# EAGLE design SensorU (EAGLE 7.2.0)
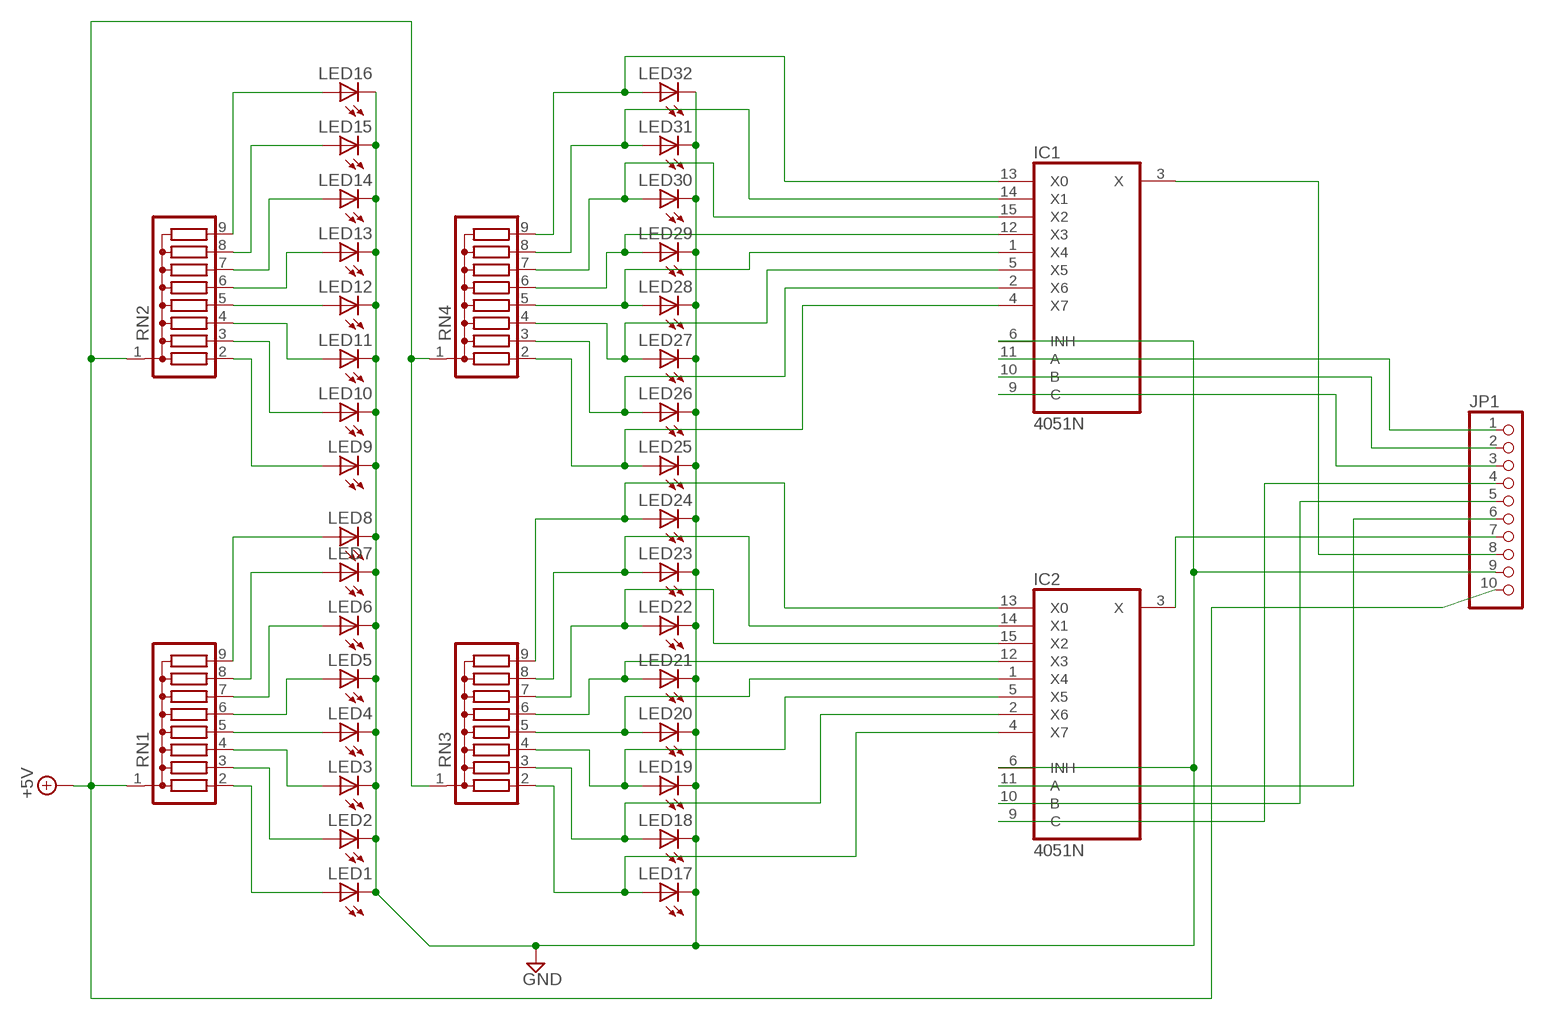
[diagram p0: schematic, sheet 1]

## Parts
IC1  4051N  [DIL16]
IC2  4051N  [DIL16]
JP1  PINHD-1X10  [1X10]
LED1  LED3MM  [LED3MM]
LED2  LED3MM  [LED3MM]
LED3  LED3MM  [LED3MM]
LED4  LED3MM  [LED3MM]
LED5  LED3MM  [LED3MM]
LED6  LED3MM  [LED3MM]
LED7  LED3MM  [LED3MM]
LED8  LED3MM  [LED3MM]
LED9  LED3MM  [LED3MM]
LED10  LED3MM  [LED3MM]
LED11  LED3MM  [LED3MM]
LED12  LED3MM  [LED3MM]
LED13  LED3MM  [LED3MM]
LED14  LED3MM  [LED3MM]
LED15  LED3MM  [LED3MM]
LED16  LED3MM  [LED3MM]
LED17  LED3MM  [LED3MM]
LED18  LED3MM  [LED3MM]
LED19  LED3MM  [LED3MM]
LED20  LED3MM  [LED3MM]
LED21  LED3MM  [LED3MM]
LED22  LED3MM  [LED3MM]
LED23  LED3MM  [LED3MM]
LED24  LED3MM  [LED3MM]
LED25  LED3MM  [LED3MM]
LED26  LED3MM  [LED3MM]
LED27  LED3MM  [LED3MM]
LED28  LED3MM  [LED3MM]
LED29  LED3MM  [LED3MM]
LED30  LED3MM  [LED3MM]
LED31  LED3MM  [LED3MM]
LED32  LED3MM  [LED3MM]
RN1  G08R  [SIL9]
RN2  G08R  [SIL9]
RN3  G08R  [SIL9]
RN4  G08R  [SIL9]

## Nets
+5V: JP1.10 RN1.1 RN2.1 RN3.1 RN4.1
GND: IC1.6(INH) IC2.6(INH) JP1.9 LED1.K(C) LED2.K(C) LED3.K(C) LED4.K(C) LED5.K(C) LED6.K(C) LED7.K(C) LED8.K(C) LED9.K(C) LED10.K(C) LED11.K(C) LED12.K(C) LED13.K(C) LED14.K(C) LED15.K(C) LED16.K(C) LED17.K(C) LED18.K(C) LED19.K(C) LED20.K(C) LED21.K(C) LED22.K(C) LED23.K(C) LED24.K(C) LED25.K(C) LED26.K(C) LED27.K(C) LED28.K(C) LED29.K(C) LED30.K(C) LED31.K(C) LED32.K(C)
N$1: LED16.A RN2.9
N$2: LED15.A RN2.8
N$3: LED14.A RN2.7
N$4: LED13.A RN2.6
N$5: LED12.A RN2.5
N$6: LED11.A RN2.4
N$7: LED10.A RN2.3
N$8: LED9.A RN2.2
N$9: LED1.A RN1.2
N$10: LED2.A RN1.3
N$11: LED3.A RN1.4
N$12: LED4.A RN1.5
N$13: LED5.A RN1.6
N$14: LED6.A RN1.7
N$15: LED7.A RN1.8
N$16: LED8.A RN1.9
N$17: IC2.3(X) JP1.7
N$18: IC1.3(X) JP1.8
N$19: IC1.11(A) JP1.1
N$20: IC1.10(B) JP1.2
N$21: IC1.9(C) JP1.3
N$22: IC2.9(C) JP1.4
N$23: IC2.10(B) JP1.5
N$24: IC2.11(A) JP1.6
N$33: IC1.13(X0) LED32.A RN4.9
N$34: IC1.14(X1) LED31.A RN4.8
N$35: IC1.15(X2) LED30.A RN4.7
N$36: IC1.12(X3) LED29.A RN4.6
N$37: IC1.1(X4) LED28.A RN4.5
N$38: IC1.5(X5) LED27.A RN4.4
N$39: IC1.2(X6) LED26.A RN4.3
N$40: IC1.4(X7) LED25.A RN4.2
N$41: IC2.13(X0) LED24.A RN3.9
N$42: IC2.14(X1) LED23.A RN3.8
N$43: IC2.15(X2) LED22.A RN3.7
N$44: IC2.12(X3) LED21.A RN3.6
N$45: IC2.1(X4) LED20.A RN3.5
N$46: IC2.5(X5) LED19.A RN3.4
N$47: IC2.2(X6) LED18.A RN3.3
N$48: IC2.4(X7) LED17.A RN3.2

## Power pins joined to a net without a drawn wire
+5V: IC1.16(VCC) IC2.16(VCC)
GND: IC1.7(VEE) IC1.8(GND) IC2.7(VEE) IC2.8(GND)

## Library data of the parts
IC1 IC2 = 40xx:4051: 8-channel ANALOG MULTIPLEXER
JP1 = pinhead:PINHD-1X10: PIN HEADER
LED1-LED32 = led:LED: LED OSRAM: - CHIPLED LG R971, LG N971, LY N971, LG Q971, LY Q971, LO R971, LY R971 LH N974, LH R974 LS Q976, LO Q976, LY Q976 LO Q996 - Hyper CHIPLED LW Q18S LB Q993, LB Q99A, LB R99A - SideLED LS A670, LO A670, LY A670, LG A670, LP A670 LB A673, LV A673, LT A673, LW A673 LH A674 LY A675 LS A676, LA A676, LO A676, LY A676, LW A676 LS A679, LY A679, LG A679 - Hyper Micro SIDELED® LS Y876, LA Y876, LO Y876, LY Y876 LT Y87S - SmartLED LW L88C, LW L88S LB L89C, LB L89S, LG L890 LS L89K, LO L89K, LY L89K LS L896, LA L896, LO L896, LY L896 - TOPLED LS T670, LO T670, LY T670, LG T670, LP T670 LSG T670, LSP T670, LSY T670, LOP T670, LYG T670 LG T671, LOG T671, LSG T671 LB T673, LV T673, LT T673, LW T673 LH T674 LS T676, LA T676, LO T676, LY T676, LB T676, LH T676, LSB T676, LW T676 LB T67C, LV T67C, LT T67C, LS T67K, LO T67K, LY T67K, LW E67C LS E67B, LA E67B, LO E67B, LY E67B, LB E67C, LV E67C, LT E67C LW T67C LS T679, LY T679, LG T679 LS T770, LO T770, LY T770, LG T770, LP T770 LB T773, LV T773, LT T773, LW T773 LH T774 LS E675, LA E675, LY E675, LS T675 LS T776, LA T776, LO T776, LY T776, LB T776 LHGB T686 LT T68C, LB T68C - Hyper Mini TOPLED® LB M676 - Mini TOPLED Santana® LG M470 LS M47K, LO M47K, LY M47K Source: http://www.osram.convergy.de LUXEON: - LUMILED® LXK2-PW12-R00, LXK2-PW12-S00, LXK2-PW14-U00, LXK2-PW14-V00 LXK2-PM12-R00, LXK2-PM12-S00, LXK2-PM14-U00 LXK2-PE12-Q00, LXK2-PE12-R00, LXK2-PE12-S00, LXK2-PE14-T00, LXK2-PE14-U00 LXK2-PB12-K00, LXK2-PB12-L00, LXK2-PB12-M00, LXK2-PB14-N00, LXK2-PB14-P00, LXK2-PB14-Q00 LXK2-PR12-L00, LXK2-PR12-M00, LXK2-PR14-Q00, LXK2-PR14-R00 LXK2-PD12-Q00, LXK2-PD12-R00, LXK2-PD12-S00 LXK2-PH12-R00, LXK2-PH12-S00 LXK2-PL12-P00, LXK2-PL12-Q00, LXK2-PL12-R00 Source: www.luxeon.com KINGBRIGHT: KA-3528ASYC Source: www.kingbright.com
RN1-RN4 = resistor-sil:G08R: SIL RESISTOR; OC_FARNELL: unknown; OC_NEWARK: unknown

## Board
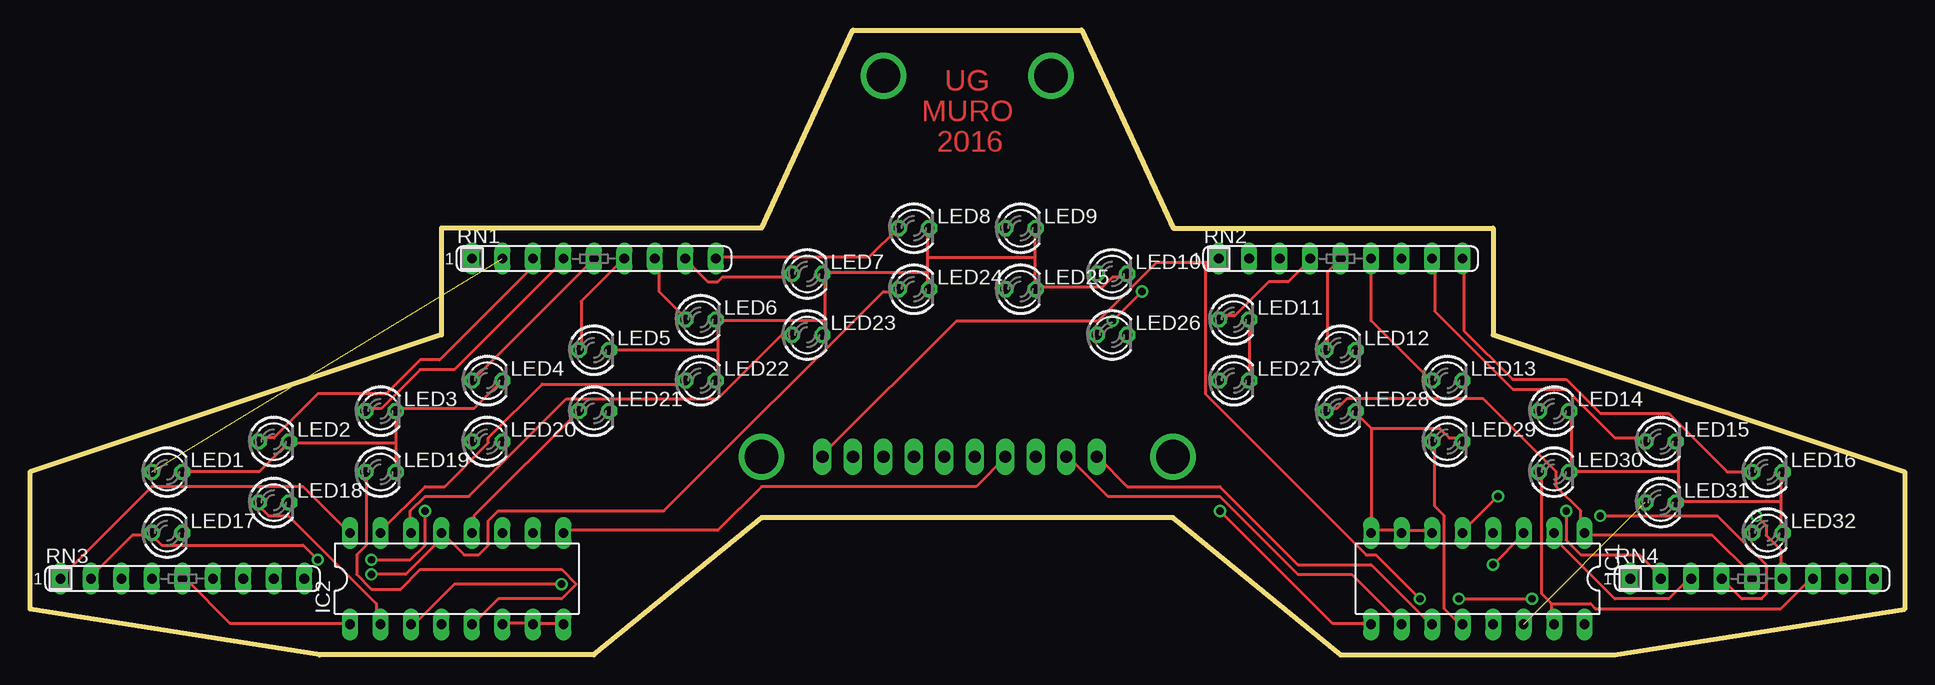
[diagram p1: board, top side]
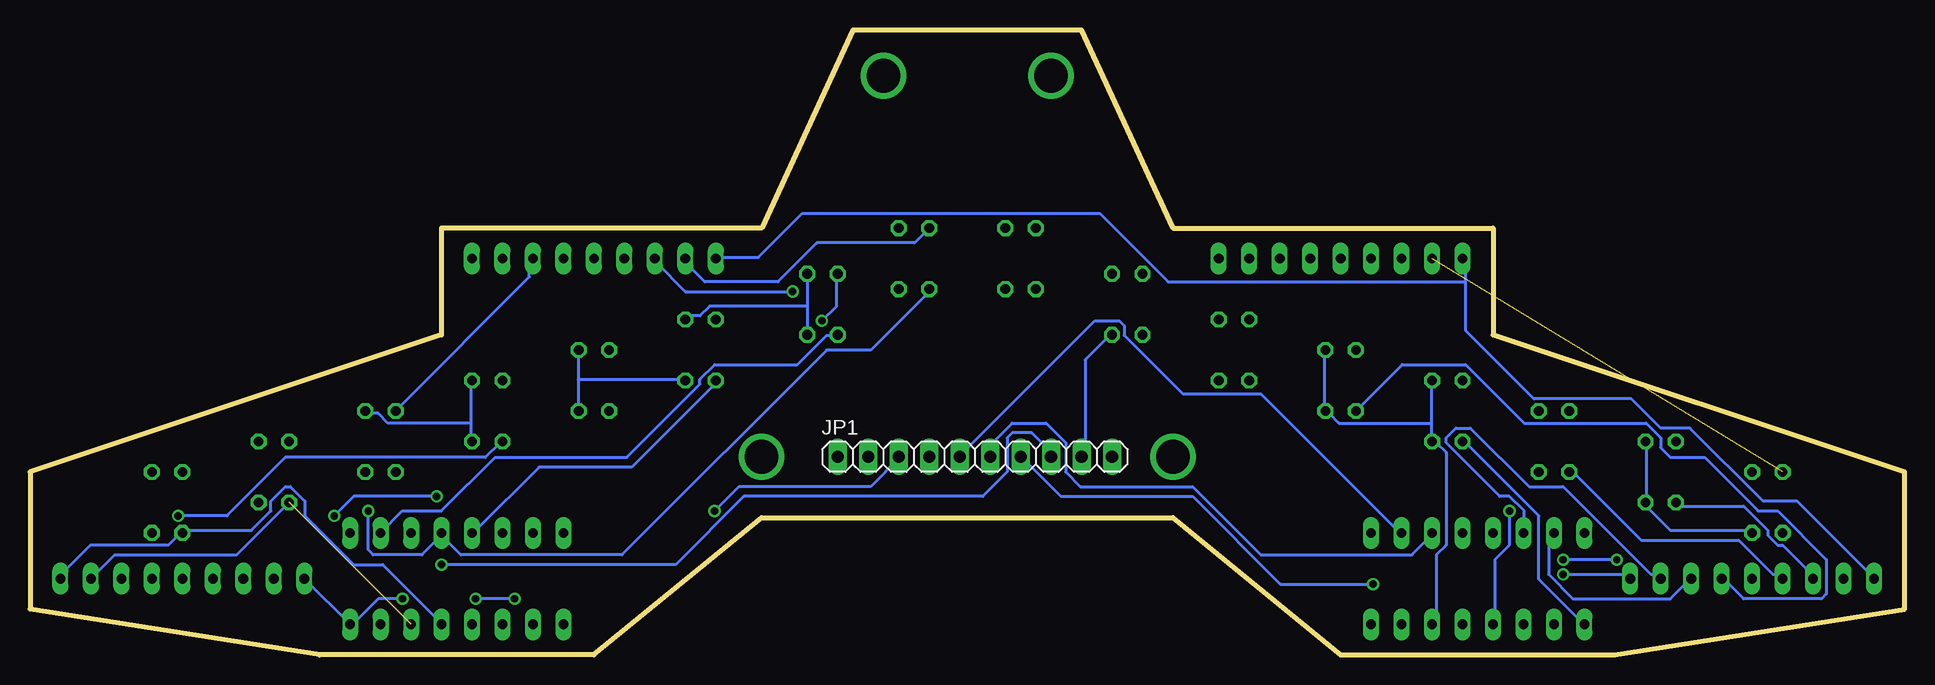
[diagram p2: board, bottom side, seen from below]

Size 156.21 x 52.07 mm. Coordinates in mm from the lower left corner, seen from the top.
Outline: 60.96,35.56 68.58,52.07 87.63,52.07 95.25,35.56 121.92,35.56 121.92,26.67 156.21,15.24 156.21,3.81 132.08,0 109.22,0 95.25,11.43 60.96,11.43 46.99,0 24.13,0 0,3.81 0,15.24 34.29,26.67 34.29,35.56 60.96,35.56
Copper layers (1*16): Top 0.035mm / dielectric 1.5mm / Bottom 0.035mm
Design rules "default": minimum track width 10mil, minimum drill 24mil, track to track 8mil, track to pad 8mil, pad to pad 8mil, via to via 8mil, smd to smd 8mil, copper to edge 40mil, drill to drill 8mil, minimum pad ring 10mil, minimum via ring 8mil, stop-mask expansion 4mil, vias tented up to drill 0mil, thermal gap 10mil

### Footprints (pad centres in the part's own frame; a part is rotated, then mirrored left to right if it is on the bottom)
DIL16 = drill 0.813 long: 1 -8.89,-3.81; 2 -6.35,-3.81; 3 -3.81,-3.81; 4 -1.27,-3.81; 5 1.27,-3.81; 6 3.81,-3.81; 7 6.35,-3.81; 8 8.89,-3.81; 9 8.89,3.81; 10 6.35,3.81; 11 3.81,3.81; 12 1.27,3.81; 13 -1.27,3.81; 14 -3.81,3.81; 15 -6.35,3.81; 16 -8.89,3.81
1X10 = drill 1.016 long: 1 -11.43,0; 2 -8.89,0; 3 -6.35,0; 4 -3.81,0; 5 -1.27,0; 6 1.27,0; 7 3.81,0; 8 6.35,0; 9 8.89,0; 10 11.43,0
LED3MM = drill 0.813 octagon: A -1.27,0; K 1.27,0
SIL9 = drill 0.813 long: 1 -10.16,0; 2 -7.62,0; 3 -5.08,0; 4 -2.54,0; 5 0,0; 6 2.54,0; 7 5.08,0; 8 7.62,0; 9 10.16,0

### Placement (x,y rotation side)
IC1  120.65,6.35 180 top
IC2  35.56,6.35 0 top
JP1  77.47,16.51 0 bottom
LED1  11.43,15.24 0 top
LED2  20.32,17.78 0 top
LED3  29.21,20.32 0 top
LED4  38.1,22.86 0 top
LED5  46.99,25.4 0 top
LED6  55.88,27.94 0 top
LED7  64.77,31.75 0 top
LED8  73.66,35.56 0 top
LED9  82.55,35.56 0 top
LED10  90.17,31.75 0 top
LED11  100.33,27.94 0 top
LED12  109.22,25.4 0 top
LED13  118.11,22.86 0 top
LED14  127,20.32 0 top
LED15  135.89,17.78 0 top
LED16  144.78,15.24 0 top
LED17  11.43,10.16 0 top
LED18  20.32,12.7 0 top
LED19  29.21,15.24 0 top
LED20  38.1,17.78 0 top
LED21  46.99,20.32 0 top
LED22  55.88,22.86 0 top
LED23  64.77,26.67 0 top
LED24  73.66,30.48 0 top
LED25  82.55,30.48 0 top
LED26  90.17,26.67 0 top
LED27  100.33,22.86 0 top
LED28  109.22,20.32 0 top
LED29  118.11,17.78 0 top
LED30  127,15.24 0 top
LED31  135.89,12.7 0 top
LED32  144.78,10.16 0 top
RN1  46.99,33.02 0 top
RN2  109.22,33.02 0 top
RN3  12.7,6.35 0 top
RN4  143.51,6.35 0 top

### Tracks (layer width: path | path; a pad name or v marks a point on that pad's centre or on a via)
+5V  (via drill 0.61)
  Top 0.254: RN3.1 2.85,6.71 10.16,14.02 22.76,14.02 26.42,10.36 IC2.16 | 97.94,32.72 93.88,32.72 89,27.84 77.22,27.84 66.24,16.87 JP1.10 | 97.94,32.72 98.75,32.72 RN2.1 | v119.08,4.67 v125.17,4.67 | v115.82,4.67 112.17,8.33 111.35,8.33 97.94,21.74 97.94,32.72
  Bottom 0.254: 36.58,31.09 36.58,27.03 30.89,21.34 22.76,21.34 20.32,18.9 17.88,18.9 11.79,12.8 8.94,12.8 2.85,6.71 RN3.1 | 36.58,31.09 36.58,32.72 RN1.1 | RN4.1 IC1.16 129.24,2.64 127.2,4.67 v125.17,4.67 | v115.82,4.67 v119.08,4.67 | 36.58,31.09 61.37,31.09 67.06,36.78 91.85,36.78 95.5,33.12 98.75,33.12 RN2.1
GND
  Top 0.254: 128.42,15.24 128.42,20.12 LED14.K | 145.9,12.8 145.9,15.24 LED16.K | 145.9,12.8 145.9,10.36 LED32.K | 137.36,15.24 137.36,17.68 LED15.K | 137.36,15.24 137.36,12.8 | 137.36,12.8 145.9,12.8 | 137.36,12.8 LED31.K | 137.36,15.24 128.42,15.24 | 128.42,15.24 LED30.K | LED11.K LED27.K | 111.76,10.36 114.2,10.36 IC1.7 114.61,10.36 116.64,10.36 IC1.6 | 111.76,18.9 111.76,10.36 | 111.76,18.9 110.54,20.12 LED28.K | 111.76,10.36 IC1.8 | 111.76,18.9 117.45,18.9 118.26,18.09 119.08,18.09 LED29.K | 30.48,17.68 LED3.K 30.48,20.52 36.98,20.52 39.01,22.55 LED4.K | 30.48,17.68 LED19.K | LED1.K 19.1,15.24 21.54,17.68 LED2.K 21.95,17.68 30.48,17.68 | IC2.6 39.42,2.64 41.86,2.64 IC2.7 42.27,2.64 44.3,2.64 IC2.8 | 83.72,33.12 83.72,35.56 LED9.K | 83.72,33.12 83.72,30.68 LED25.K 84.12,30.68 89.41,30.68 90.22,31.5 91.44,31.5 LED10.K | 57.3,27.84 57.3,25.4 | 57.3,25.4 57.3,22.96 LED22.K | 57.3,25.4 LED5.K | 74.78,33.12 74.78,35.56 LED8.K | 74.78,33.12 74.78,31.9 | 74.78,31.9 74.78,30.68 LED24.K | 66.24,27.84 66.24,31.5 LED7.K 66.24,31.9 74.78,31.9 | 66.24,27.84 66.24,27.03 LED23.K | 66.24,27.84 57.3,27.84 | 57.3,27.84 LED6.K | 74.78,33.12 83.72,33.12
  Bottom 0.254: 119.48,19.3 119.48,22.55 LED13.K | 119.48,19.3 119.48,18.09 LED29.K | 110.54,22.96 110.54,25.4 LED12.K | 110.54,22.96 110.54,20.52 LED28.K | 110.54,22.96 101.6,22.96 LED27.K | 119.48,19.3 126.39,19.3 127.2,20.12 128.02,20.12 LED14.K | LED17.K 13.01,10.36 19.51,10.36 21.54,12.39 LED18.K 21.54,12.8 21.54,17.68 LED2.K | 39.42,19.3 39.42,22.55 LED4.K | 39.42,19.3 39.42,18.09 LED20.K 39.01,17.68 38.2,16.87 38.2,9.14 39.01,8.33 39.01,2.64 IC2.6 | LED10.K 91.44,29.06 | 91.44,29.06 LED26.K | LED5.K 48.36,25.4 48.36,20.52 LED21.K 47.95,20.12 47.14,19.3 39.42,19.3 | JP1.9 68.28,16.87 68.28,24.59 66.24,26.62 LED23.K | 91.44,29.06 99.57,29.06 100.38,28.24 101.6,28.24 LED11.K
N$1
  Top 0.254: LED16.A 141.43,15.24 136.55,20.12 130.86,20.12 128.02,22.96 123.55,22.96 119.48,27.03 119.48,32.72 RN2.9
N$2
  Top 0.254: LED15.A 134.52,18.09 132.08,18.09 128.02,22.15 123.55,22.15 117.04,28.65 117.04,32.72 RN2.8
N$3
  Bottom 0.254: RN2.7 114.61,32.72 114.61,31.5 125.58,20.52 LED14.A
N$4
  Top 0.254: RN2.6 111.76,27.84 116.64,22.96 LED13.A
N$5
  Top 0.254: RN2.5 108.1,31.9 108.1,25.4 LED12.A
N$6
  Top 0.254: LED11.A 99.16,28.24 100.38,28.24 103.23,31.09 104.85,31.09 106.48,32.72 RN2.4
N$7  (via drill 0.61)
  Top 0.254: v92.66,30.28 v90.22,27.84
  Bottom 0.254: v90.22,27.84 89,29.06 89,31.5 LED10.A | v92.66,30.28 101.6,30.28 104.04,32.72 RN2.3
N$8
  Bottom 0.254: LED9.A 82.5,34.34 90.63,34.34 93.88,31.09 99.97,31.09 101.6,32.72 RN2.2
N$9  (1 unrouted)
N$10
  Top 0.254: LED2.A 19.1,18.09 20.32,18.09 23.98,21.74 29.67,21.74 32.51,24.59 34.14,24.59 42.27,32.72 RN1.3
N$11
  Top 0.254: LED3.A 28.04,20.52 29.26,20.52 32.51,23.77 35.36,23.77 44.3,32.72 RN1.4
N$12
  Top 0.254: LED4.A 36.98,22.96 46.74,32.72 RN1.5
N$13
  Top 0.254: LED5.A 45.92,25.4 45.92,29.46 49.17,32.72 RN1.6
N$14
  Top 0.254: RN1.7 52.43,32.72 52.43,30.28 54.46,28.24 LED6.A
N$15
  Top 0.254: LED7.A 63.4,31.5 57.71,31.5 57.3,31.09 56.49,31.09 54.86,32.72 RN1.8
N$16
  Top 0.254: RN1.9 57.3,33.12 69.9,33.12 72.34,35.56 LED8.A
N$17  (via drill 0.61)
  Top 0.254: v44.3,5.89 35.36,5.89 32.11,2.64 IC2.3
  Bottom 0.254: v44.3,5.89 52.02,5.89 59.33,13.21 70.31,13.21 73.56,16.46 JP1.7
N$18  (via drill 0.61)
  Top 0.254: v121.92,7.52 124.36,9.96 IC1.3
  Bottom 0.254: v121.92,7.52 102.41,7.52 96.72,13.21 76.81,13.21 74.78,15.24 74.78,18.09 74.37,18.49 72.75,18.49 71.12,16.87 JP1.8
N$19
  Top 0.254: IC1.11 116.64,2.64 111.76,7.52 105.66,7.52 99.16,14.02 91.44,14.02 89,16.46 JP1.1
N$20
  Top 0.254: IC1.10 110.13,6.71 105.66,6.71 99.16,13.21 89.81,13.21 86.56,16.46 JP1.2
N$21  (via drill 0.61)
  Top 0.254: v99.16,11.99 108.51,2.64 111.76,2.64 IC1.9
  Bottom 0.254: v99.16,11.99 97.13,14.02 86.16,14.02 83.72,16.46 JP1.3
N$22
  Top 0.254: IC2.9 44.7,10.36 57.3,10.36 60.96,14.02 78.84,14.02 81.28,16.46 JP1.4
N$23
  Bottom 0.254: IC2.10 42.27,10.36 53.65,21.74 60.15,21.74 65.02,26.62 65.02,27.43 65.43,27.84 67.46,27.84 78.44,16.87 JP1.5
N$24
  Bottom 0.254: IC2.11 39.42,9.96 41.05,8.33 53.65,8.33 59.33,14.02 68.68,14.02 69.9,15.24 69.9,17.68 71.53,19.3 74.37,19.3 76,17.68 76,16.87 JP1.6
N$25  (via drill 2.8 pad 1.93)
  other vias: 60.96,16.51
N$26  (via drill 2.8 pad 1.93)
  other vias: 95.25,16.51
N$27  (via drill 2.8 pad 1.93)
  other vias: 71.12,48.26
N$28  (via drill 2.8 pad 1.93)
  other vias: 85.09,48.26
N$33
  Bottom 0.254: IC1.13 121.92,2.64 126.8,7.52 129.24,7.52 133.3,11.58 133.3,12.8 134.52,14.02 134.93,14.02 136.14,12.8 136.14,11.99 137.77,10.36 143.46,10.36 LED32.A 143.87,9.96 144.68,9.14 151.18,9.14 153.62,6.71 RN4.9
N$34  (1 unrouted)
  Bottom 0.254: LED31.A 138.99,8.33 149.15,8.33 RN4.8
N$35
  Top 0.254: 126.8,4.27 125.98,5.08 125.98,15.24 LED30.A | 126.8,4.27 126.8,2.64 IC1.15 | 126.8,4.27 130.05,4.27 130.45,3.86 145.9,3.86 148.34,6.3 RN4.7
N$36  (via drill 0.61)
  Top 0.254: LED29.A 117.04,17.68 117.04,12.39 117.86,11.58 117.86,3.86 119.08,2.64 IC1.12 | v143.87,11.58 144.68,10.77 144.68,9.96 145.9,8.74 145.9,6.71 RN4.6
  Bottom 0.254: v143.87,11.58 139.8,11.58 134.93,16.46 118.26,16.46 117.04,17.68 LED29.A
N$37
  Top 0.254: RN4.5 143.46,6.71 140.21,9.96 129.64,9.96 IC1.1 129.24,10.36 129.24,11.99 127.2,14.02 127.2,15.24 121.11,21.34 109.73,21.34 108.92,20.52 108.1,20.52 LED28.A
N$38  (via drill 0.61)
  Top 0.254: RN4.4 142.65,4.67 144.27,4.67 144.68,5.08 144.68,7.52 140.61,11.58 v130.86,11.58 | v122.33,13.21 119.48,10.36 IC1.5
  Bottom 0.254: IC1.5 119.08,10.36 113.79,15.65 106.07,15.65 99.16,22.55 LED27.A | v130.86,11.58 129.24,13.21 v122.33,13.21
N$39
  Top 0.254: IC1.2 127.2,9.96 127.2,9.55 132.08,4.67 136.55,4.67 138.18,6.3 RN4.3
  Bottom 0.254: IC1.2 125.17,11.99 121.92,11.99 117.45,16.46 106.48,16.46 100.38,22.55 100.38,22.96 99.16,24.18 92.25,24.18 89.81,26.62 89,26.62 LED26.A
N$40  (via drill 0.61)
  Top 0.254: v128.02,11.99 128.02,9.55 129.24,8.33 134.11,8.33 135.74,6.71 RN4.2
  Bottom 0.254: 121.92,9.96 120.29,8.33 106.88,8.33 89.81,25.4 86.16,25.4 81.28,30.28 LED25.A | v128.02,11.99 128.02,8.74 127.61,8.33 123.55,8.33 121.92,9.96 | 121.92,9.96 IC1.4
N$41  (via drill 0.61)
  Top 0.254: v28.45,6.71 31.29,6.71 34.54,9.96 | 34.54,9.96 36.17,8.33 37.39,8.33 38.2,9.14 38.2,11.18 39.01,11.99 52.83,11.99 71.12,30.28 72.34,30.28 LED24.A | 34.54,9.96 IC2.13
  Bottom 0.254: v28.45,6.71 23.16,6.71 RN3.9
N$42
  Top 0.254: LED23.A 63.4,26.62 62.59,26.62 57.3,21.34 44.7,21.34 36.58,13.21 32.92,13.21 31.7,11.99 31.7,10.36 IC2.14
  Bottom 0.254: RN3.8 20.32,6.71 21.13,6.71 28.45,14.02 31.29,14.02 36.17,18.9 37.39,18.9 38.2,18.09 38.2,17.68 33.73,13.21 32.92,13.21 31.7,11.99 31.7,10.36 IC2.14
N$43
  Top 0.254: LED22.A 54.46,22.55 42.67,22.55 38.2,18.09 38.2,17.68 34.54,14.02 32.92,14.02 29.26,10.36 IC2.15
  Bottom 0.254: RN3.7 17.88,6.3 19.51,4.67 27.64,4.67 29.67,6.71 29.67,9.55 29.26,9.96 IC2.15
N$44
  Top 0.254: LED21.A 36.98,11.58 36.98,10.36 IC2.12
  Bottom 0.254: LED21.A 41.86,24.18 36.58,24.18 31.7,19.3 21.54,19.3 20.32,18.09 20.32,17.27 19.51,16.46 16.66,16.46 12.19,11.99 10.57,11.99 6.5,7.93 6.5,5.08 6.91,4.67 13.41,4.67 15.04,6.3 RN3.6
N$45
  Top 0.254: IC2.1 26.42,2.64 16.66,2.64 13.01,6.3 RN3.5
  Bottom 0.254: LED20.A 36.58,17.68 30.48,11.58 30.48,6.3 26.82,2.64 IC2.1
N$46
  Top 0.254: IC2.5 36.98,2.64 39.01,4.67 44.3,4.67 45.52,5.89 44.3,7.11 32.51,7.11 30.89,5.49 28.45,5.49 27.23,6.71 27.23,8.33 28.04,9.14 28.04,15.24 LED19.A
  Bottom 0.254: RN3.4 10.16,6.71 10.97,6.71 13.82,9.55 21.95,9.55 27.64,15.24 LED19.A
N$47
  Top 0.254: IC2.2 28.85,2.64 28.85,4.27 21.54,11.58 19.91,11.58 19.1,12.39 LED18.A
  Bottom 0.254: RN3.3 7.72,6.71 10.16,9.14 10.57,9.14 11.38,9.96 11.38,10.36 13.41,12.39 18.69,12.39 LED18.A
N$48  (via drill 0.61)
  Top 0.254: 10.16,9.96 8.53,9.96 5.28,6.71 RN3.2 | v32.92,11.99 32.92,9.14 31.7,7.93 v28.45,7.93 | v23.98,7.93 22.76,9.14 10.97,9.14 10.16,9.96 | 10.16,9.96 LED17.A
  Bottom 0.254: v32.92,11.99 32.92,9.14 34.14,7.93 34.14,2.64 IC2.4 | v23.98,7.93 v28.45,7.93

### Text on the board
Top: UG | MURO | 2016